# EAGLE design DESIGN7SR_PCB (EAGLE 9.3.2)
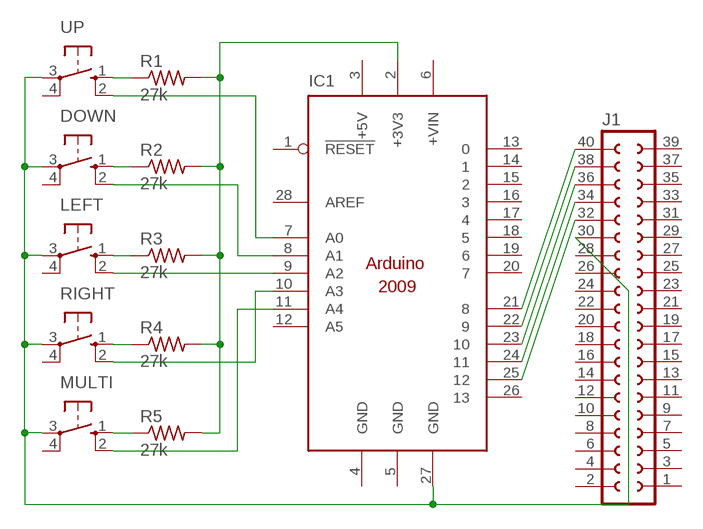
[diagram p0: schematic, sheet 1]

## Parts
DOWN  10-XX  [B3F-10XX]
IC1  ARDUINO2009_10  [ARDUINO2009]
J1  SOCKET-40V  [S40V]
LEFT  10-XX  [B3F-10XX]
MULTI  10-XX  [B3F-10XX]
R1  27k  R-US_0204/2V  [0204V]
R2  27k  R-US_0204/2V  [0204V]
R3  27k  R-US_0204/2V  [0204V]
R4  27k  R-US_0204/2V  [0204V]
R5  27k  R-US_0204/2V  [0204V]
RIGHT  10-XX  [B3F-10XX]
UP  10-XX  [B3F-10XX]

## Nets
N$1: IC1.21 J1.40
N$2: IC1.22 J1.38
N$3: IC1.23 J1.36
N$4: IC1.24 J1.34
N$5: IC1.25 J1.32
N$6: IC1.11(A4) MULTI.2(S1)
N$7: DOWN.3(P) IC1.27(GND) J1.30 LEFT.3(P) MULTI.3(P) RIGHT.3(P) UP.3(P)
N$8: IC1.10(A3) RIGHT.2(S1)
N$9: R1.1 UP.1(S)
N$10: DOWN.1(S) R2.1
N$11: LEFT.1(S) R3.1
N$12: R4.1 RIGHT.1(S)
N$13: MULTI.1(S) R5.1
N$14: IC1.2(+3V3) R1.2 R2.2 R3.2 R4.2 R5.2
N$15: IC1.9(A2) LEFT.2(S1)
N$16: DOWN.2(S1) IC1.8(A1)
N$17: IC1.7(A0) UP.2(S1)
Unconnected: DOWN.4(P1) IC1.1(!RESET) IC1.6(+VIN) IC1.12(A5) IC1.13 IC1.14 IC1.15 IC1.16 IC1.17 IC1.18 IC1.19 IC1.20 IC1.26 IC1.28(AREF) J1.1 J1.2 J1.3 J1.4 J1.5 J1.6 J1.7 J1.8 J1.9 J1.10 J1.11 J1.12 J1.13 J1.14 J1.15 J1.16 J1.17 J1.18 J1.19 J1.20 J1.21 J1.22 J1.23 J1.24 J1.25 J1.26 J1.27 J1.28 J1.29 J1.31 J1.33 J1.35 J1.37 J1.39 LEFT.4(P1) MULTI.4(P1) RIGHT.4(P1) UP.4(P1)

## Power pins joined to a net without a drawn wire
+5V: IC1.3(+5V)
GND: IC1.4(GND) IC1.5(GND)

## Library data of the parts
DOWN LEFT MULTI RIGHT UP = switch-omron:10-XX: OMRON SWITCH; MPN: B3F-1000; OC_FARNELL: 176432; OC_NEWARK: 36M3542
IC1 = arduino:ARDUINO2009_1: The Arduino Duemilanove ("2009") is a microcontroller board based on the ATmega168 or ATmega328. - 14 digital input/output pins (of which 6 can be used as PWM outputs) - 6 analog inputs, a 16 MHz crystal oscillator - USB connection - power jack - ISP header - reset button It contains everything needed to support the microcontroller; simply connect it to a computer with a USB cable or power it with a AC-to-DC adapter or battery to get started http://arduino.cc/en/Main/ArduinoBoardDuemilanove
J1 = con-3m-skt-header:SOCKET-40: 40 pin PCB Socket (3m 85xx/51xx)
R1-R5 = rcl:R-US_: RESISTOR, American symbol; SPICEPREFIX: R

## Board
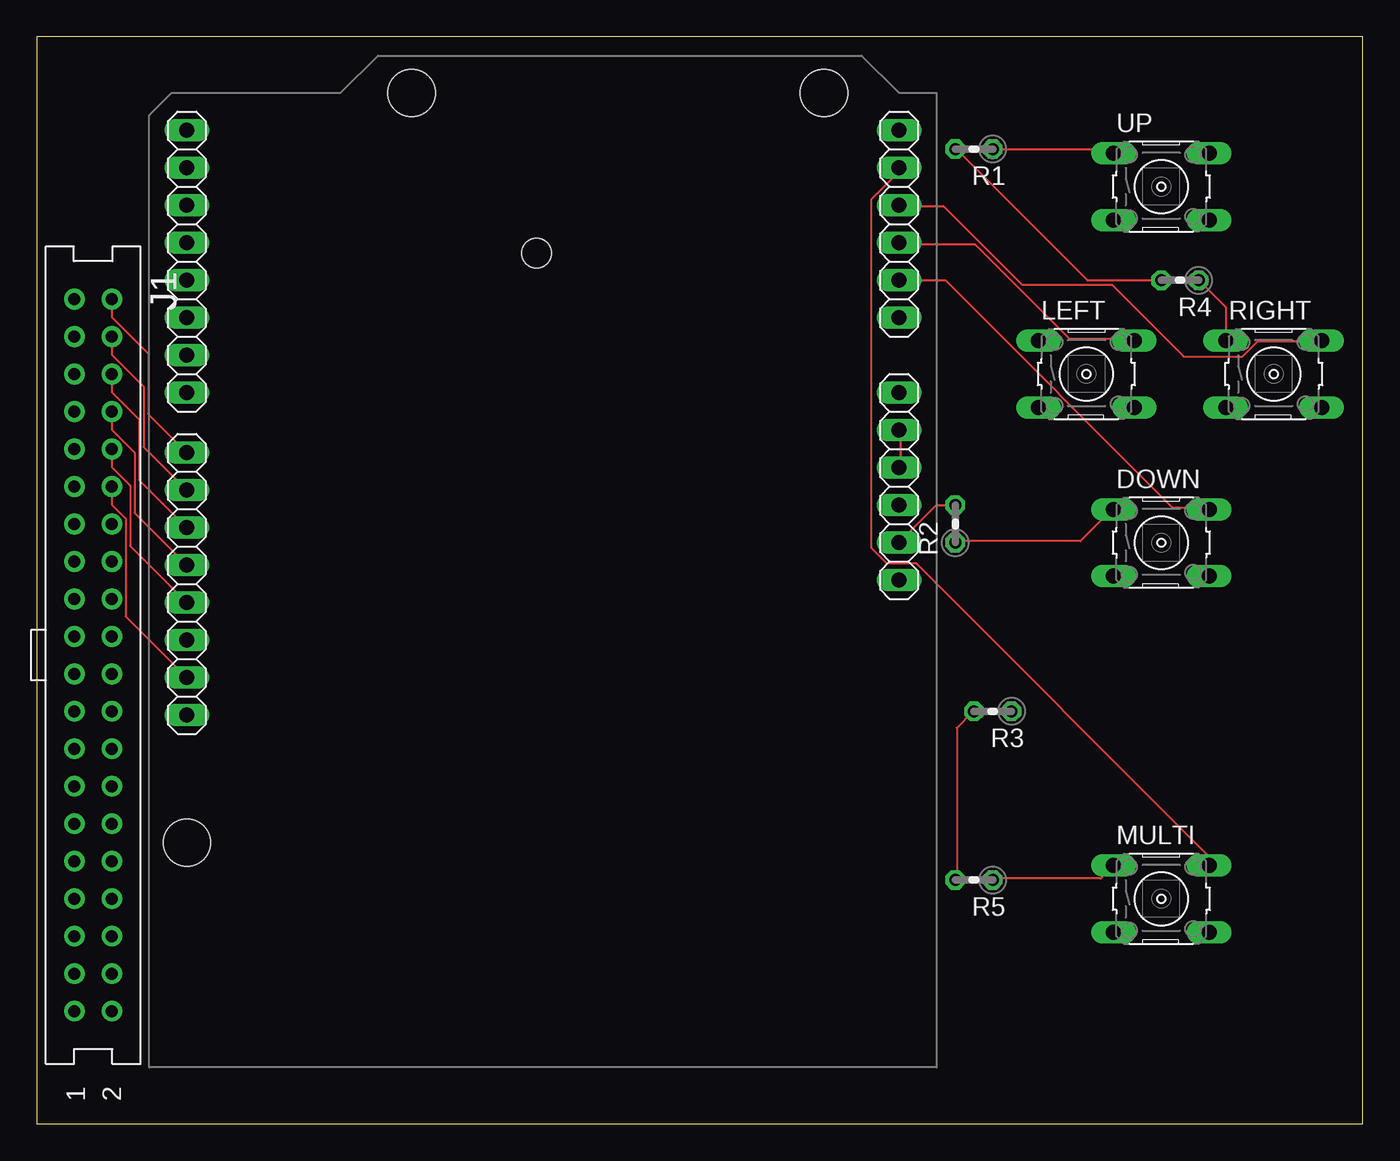
[diagram p1: board, top side]
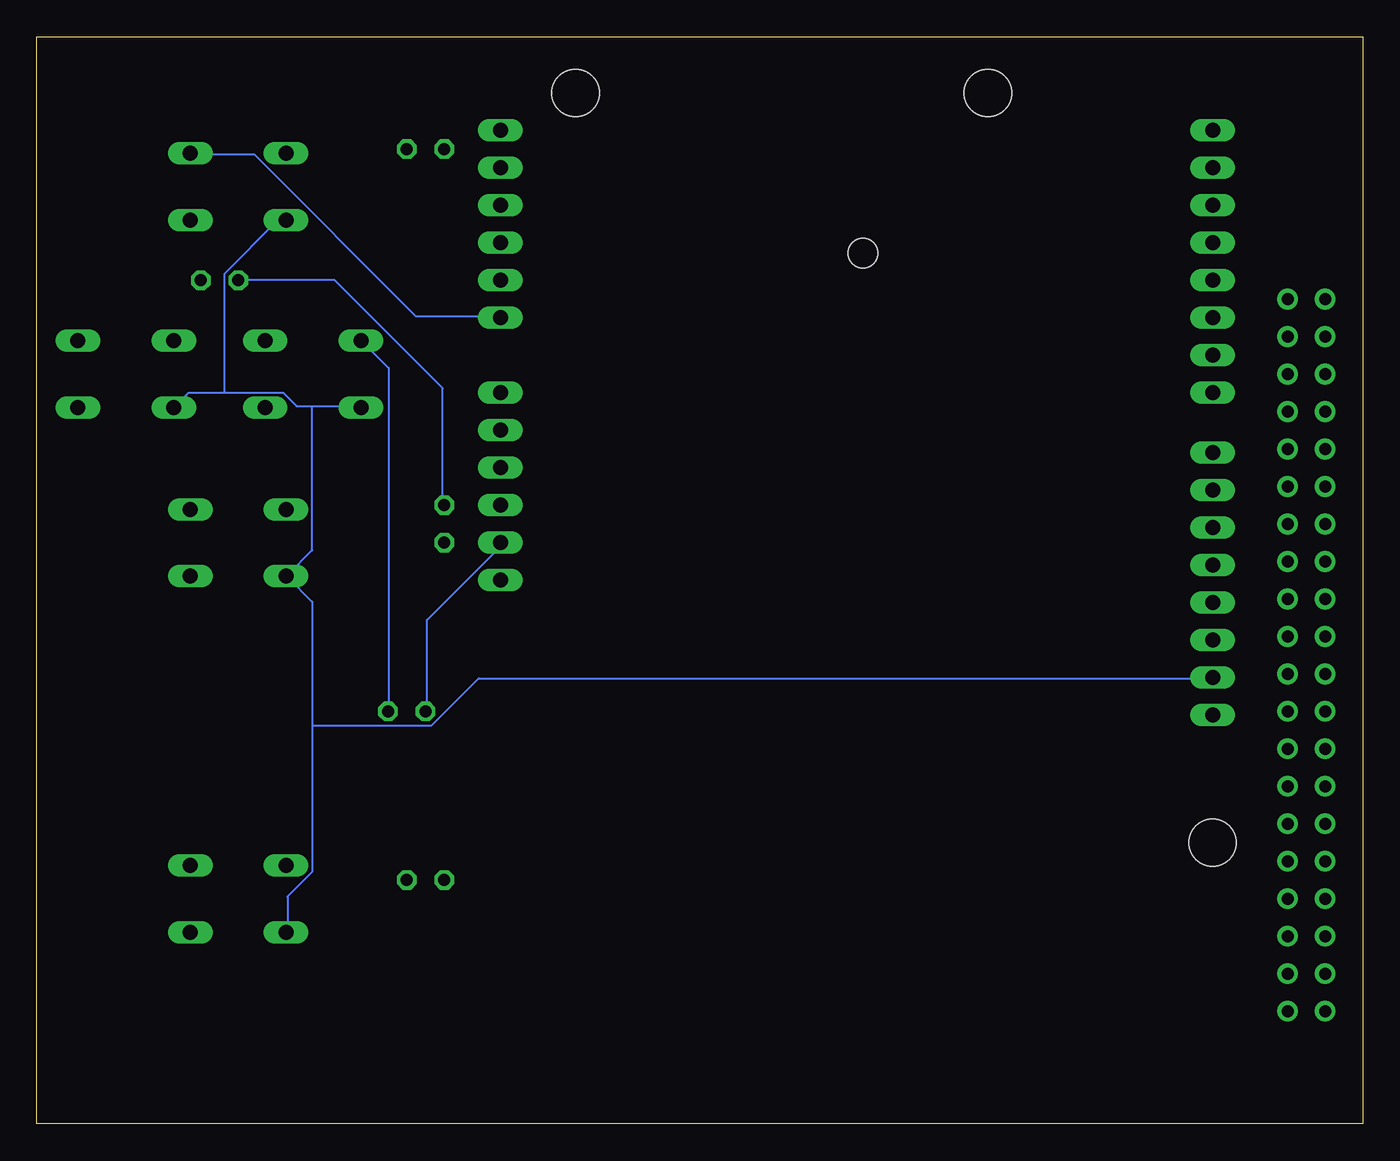
[diagram p2: board, bottom side, seen from below]

Size 89.84 x 73.65 mm. Coordinates in mm from the lower left corner, seen from the top.
Outline: 0,0 89.84,0 89.84,73.65 0,73.65 0,0
Copper layers (1*16): Top 0.035mm / dielectric 1.5mm / Bottom 0.035mm
Design rules "default": minimum track width 6mil, minimum drill 0.35mm, track to track 6mil, track to pad 6mil, pad to pad 6mil, via to via 6mil, smd to smd 6mil, copper to edge 40mil, drill to drill 6mil, minimum pad ring 10mil, minimum via ring 8mil, stop-mask expansion 4mil, vias tented up to drill 0mil, thermal gap 10mil

### Footprints (pad centres in the part's own frame; a part is rotated, then mirrored left to right if it is on the bottom)
B3F-10XX = drill 1.016 long: 1 -3.251,2.261; 2 3.251,2.261; 3 -3.251,-2.261; 4 3.251,-2.261
ARDUINO2009 = drill 1.016 long: 1 33.02,2.54; 2 35.56,2.54; 3 38.1,2.54; 4 40.64,2.54; 5 43.18,2.54; 6 45.72,2.54; 7 50.8,2.54; 8 53.34,2.54; 9 55.88,2.54; 10 58.42,2.54; 11 60.96,2.54; 12 63.5,2.54; 13 63.5,50.8; 14 60.96,50.8; 15 58.42,50.8; 16 55.88,50.8; 17 53.34,50.8; 18 50.8,50.8; 19 48.26,50.8; 20 45.72,50.8; 21 41.656,50.8; 22 39.116,50.8; 23 36.576,50.8; 24 34.036,50.8; 25 31.496,50.8; 26 28.956,50.8; 27 26.416,50.8; 28 23.876,50.8 | hole 3.2: 15.24,50.8; 66.04,35.56; 66.04,7.62 | hole 2: 55.17,27.114
S40V = drill 0.8 pad 1.4: 1 24.13,-1.27; 2 24.13,1.27; 3 21.59,-1.27; 4 21.59,1.27; 5 19.05,-1.27; 6 19.05,1.27; 7 16.51,-1.27; 8 16.51,1.27; 9 13.97,-1.27; 10 13.97,1.27; 11 11.43,-1.27; 12 11.43,1.27; 13 8.89,-1.27; 14 8.89,1.27; 15 6.35,-1.27; 16 6.35,1.27; 17 3.81,-1.27; 18 3.81,1.27; 19 1.27,-1.27; 20 1.27,1.27; 21 -1.27,-1.27; 22 -1.27,1.27; 23 -3.81,-1.27; 24 -3.81,1.27; 25 -6.35,-1.27; 26 -6.35,1.27; 27 -8.89,-1.27; 28 -8.89,1.27; 29 -11.43,-1.27; 30 -11.43,1.27; 31 -13.97,-1.27; 32 -13.97,1.27; 33 -16.51,-1.27; 34 -16.51,1.27; 35 -19.05,-1.27; 36 -19.05,1.27; 37 -21.59,-1.27; 38 -21.59,1.27; 39 -24.13,-1.27; 40 -24.13,1.27
0204V = drill 0.813 octagon: 1 -1.27,0; 2 1.27,0

### Placement (x,y rotation side)
DOWN  76.2,39.37 0 top
IC1  60.96,3.81 90 top
J1  3.81,31.75 270 top
LEFT  71.12,50.8 0 top
MULTI  76.2,15.24 0 top
R1  63.5,66.04 180 top
R2  62.23,40.64 90 top
R3  64.77,27.94 180 top
R4  77.47,57.15 180 top
R5  63.5,16.51 180 top
RIGHT  83.82,50.8 0 top
UP  76.2,63.5 0 top

### Tracks (layer width: path | path; a pad name or v marks a point on that pad's centre or on a via)
GND
  Top 0.152: IC1.4 58.52,44.5 58.52,46.94 IC1.5
N$1
  Top 0.152: IC1.21 7.53,48.09 7.53,52.2 5.08,54.65 J1.40
N$2
  Top 0.152: IC1.22 7.23,45.86 7.23,49.97 5.08,52.11 J1.38
N$3
  Top 0.152: IC1.23 6.92,43.62 6.92,47.73 5.08,49.57 J1.36
N$4
  Top 0.152: IC1.24 6.62,41.39 6.62,45.49 5.08,47.03 J1.34
N$5
  Top 0.152: IC1.25 6.31,39.15 6.31,43.26 5.08,44.49 J1.32
N$6
  Top 0.152: IC1.11 58.37,64.77 58.37,64.47 56.54,62.64 56.54,39.01 57.61,37.95 59.59,37.95 79.4,18.14 79.4,17.53 MULTI.2
N$7
  Top 0.152: J1.30 5.08,41.95 6.01,41.02 6.01,34.38 IC1.27
  Bottom 0.152: 71.17,48.62 72.24,48.62 73.15,49.53 77.11,49.53 | 71.17,48.62 67.97,48.62 LEFT.3 | 77.11,49.53 79.55,49.53 80.47,48.62 RIGHT.3 | 77.11,49.53 77.11,57.61 73.61,61.11 73,61.11 UP.3 | 71.17,26.98 71.17,35.36 72.85,37.03 DOWN.3 72.85,37.19 71.17,38.86 71.17,48.62 | 71.17,26.98 71.17,17.07 72.85,15.39 72.85,13.11 MULTI.3 | 71.17,26.98 63.09,26.98 59.89,30.18 10.21,30.18 IC1.27
N$8
  Top 0.152: RIGHT.2 87.02,53.03 82.75,53.03 81.69,51.97 77.72,51.97 72.85,56.84 66.75,56.84 61.42,62.18 58.52,62.18 IC1.10
N$9
  Top 0.152: R1.1 72.67,66.04 UP.1
N$10
  Top 0.152: R2.1 62.33,39.47 70.71,39.47 72.85,41.6 DOWN.1
N$11
  Bottom 0.152: R3.1 65.99,28.04 65.99,51.21 67.82,53.03 LEFT.1
N$12
  Top 0.152: R4.1 80.57,55.32 RIGHT.1
N$13
  Top 0.152: R5.1 64.77,16.61 72.08,16.61 72.85,17.37 MULTI.1
N$14
  Top 0.152: R4.2 71.17,57.15 62.33,65.99 R1.2 | R2.2 60.96,41.91 IC1.2 | R5.2 62.33,16.61 62.33,26.82 63.4,27.89 R3.2
  Bottom 0.152: IC1.2 58.52,39.32 58.52,39.01 63.4,34.14 63.4,28.04 R3.2 | R4.2 69.65,57.15 62.33,49.84 62.33,41.91 R2.2
N$15
  Top 0.152: LEFT.2 74.37,53.19 69.95,53.19 63.55,59.59 58.52,59.59 IC1.9
N$16
  Top 0.152: IC1.8 61.57,57.15 76.96,41.76 79.4,41.76 DOWN.2
N$17
  Bottom 0.152: IC1.7 58.52,54.71 64.16,54.71 75.13,65.68 79.4,65.68 UP.2